# EAGLE design aruduino-shield (EAGLE 9.6.2)
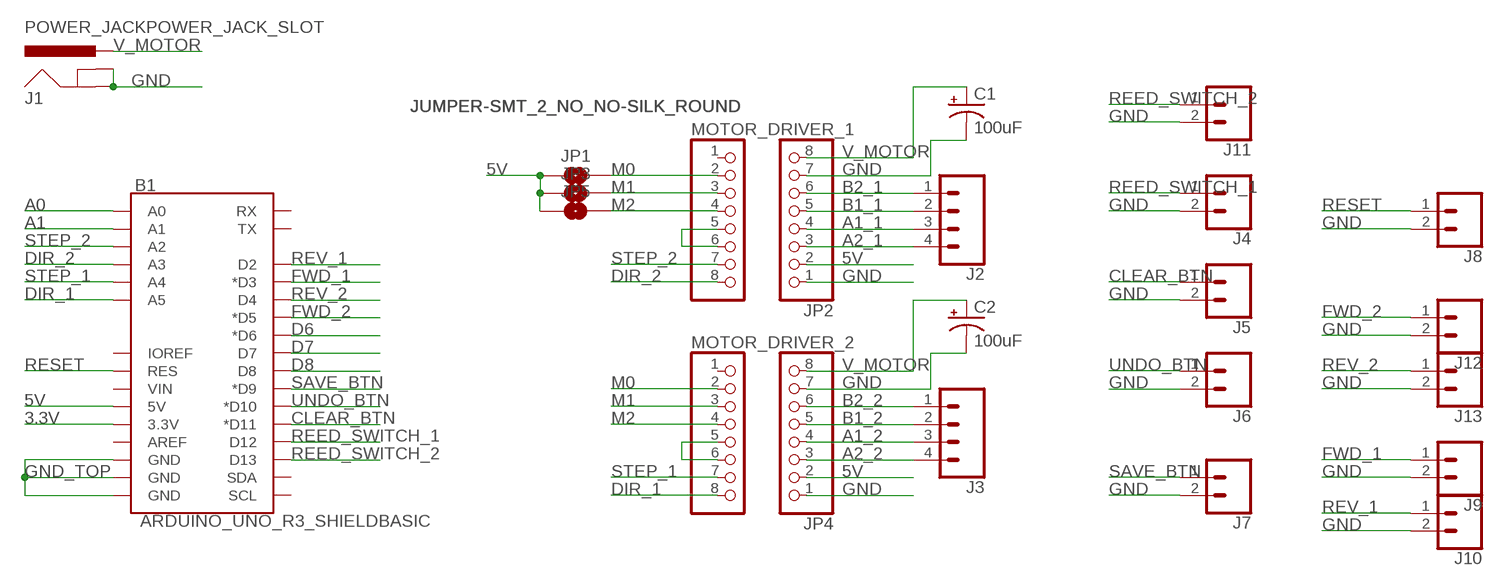
[diagram p0: schematic, sheet 1]

## Parts
B1  ARDUINO_UNO_R3_SHIELDBASIC  [UNO_R3_SHIELD]
C1  100uF  100UF-POLAR-RADIAL-2.5MM-25V-20%  [CPOL-RADIAL-2.5MM-6.5MM]
C2  100uF  100UF-POLAR-RADIAL-2.5MM-25V-20%  [CPOL-RADIAL-2.5MM-6.5MM]
J1  POWER_JACKPOWER_JACK_SLOT  [POWER_JACK_PTH_SLOT]
J2  CONN_04SCREW  [SCREWTERMINAL-3.5MM-4]
J3  CONN_04SCREW  [SCREWTERMINAL-3.5MM-4]
J4  CONN_02  [1X02]
J5  CONN_02  [1X02]
J6  CONN_02  [1X02]
J7  CONN_02  [1X02]
J8  CONN_02  [1X02]
J9  CONN_02  [1X02]
J10  CONN_02  [1X02]
J11  CONN_02  [1X02]
J12  CONN_02  [1X02]
J13  CONN_02  [1X02]
JP1  JUMPER-SMT_2_NO_NO-SILK_ROUND  [SMT-JUMPER_2_NO_NO-SILK_ROUND]
JP2  PINHD-1X8CLEANBIG  [1X08-CLEANBIG]
JP3  JUMPER-SMT_2_NO_NO-SILK_ROUND  [SMT-JUMPER_2_NO_NO-SILK_ROUND]
JP4  PINHD-1X8CLEANBIG  [1X08-CLEANBIG]
JP5  JUMPER-SMT_2_NO_NO-SILK_ROUND  [SMT-JUMPER_2_NO_NO-SILK_ROUND]
MOTOR_DRIVER_1  PINHD-1X8CLEANBIG  [1X08-CLEANBIG]
MOTOR_DRIVER_2  PINHD-1X8CLEANBIG  [1X08-CLEANBIG]

## Nets
3.3V: B1.3.3V
5V: B1.5V JP1.1 JP2.2 JP3.1 JP4.2 JP5.1
A0: B1.A0
A1: B1.A1
A1_1: J2.3 JP2.4
A1_2: J3.3 JP4.4
A2_1: J2.4 JP2.3
A2_2: J3.4 JP4.3
B1_1: J2.2 JP2.5
B1_2: J3.2 JP4.5
B2_1: J2.1 JP2.6
B2_2: J3.1 JP4.6
CLEAR_BTN: B1.D11(*D11) J5.1
D6: B1.D6(*D6)
D7: B1.D7
D8: B1.D8
DIR_1: B1.A5 MOTOR_DRIVER_2.8
DIR_2: B1.A3 MOTOR_DRIVER_1.8
FWD_1: B1.D3(*D3) J9.1
FWD_2: B1.D5(*D5) J12.1
GND: C1.2(-) C2.2(-) J1.GND J1.GNDBREAK J4.2 J5.2 J6.2 J7.2 J8.2 J9.2 J10.2 J11.2 J12.2 J13.2 JP2.1 JP2.7 JP4.1 JP4.7
GND_TOP: B1.GND@0(GND) B1.GND@1(GND) B1.GND@2(GND)
M0: JP1.2 MOTOR_DRIVER_1.2 MOTOR_DRIVER_2.2
M1: JP3.2 MOTOR_DRIVER_1.3 MOTOR_DRIVER_2.3
M2: JP5.2 MOTOR_DRIVER_1.4 MOTOR_DRIVER_2.4
N$1: MOTOR_DRIVER_2.5 MOTOR_DRIVER_2.6
N$2: MOTOR_DRIVER_1.5 MOTOR_DRIVER_1.6
REED_SWITCH_1: B1.D12 J4.1
REED_SWITCH_2: B1.D13 J11.1
RESET: B1.RES J8.1
REV_1: B1.D2 J10.1
REV_2: B1.D4 J13.1
SAVE_BTN: B1.D9(*D9) J7.1
STEP_1: B1.A4 MOTOR_DRIVER_2.7
STEP_2: B1.A2 MOTOR_DRIVER_1.7
UNDO_BTN: B1.D10(*D10) J6.1
V_MOTOR: C1.1(+) C2.1(+) J1.PWR JP2.8 JP4.8
Unconnected: B1.AREF B1.IOREF B1.RX B1.SCL B1.SDA B1.TX B1.VIN MOTOR_DRIVER_1.1 MOTOR_DRIVER_2.1

## Library data of the parts
B1 = SparkFun-Boards:ARDUINO_UNO_R3_SHIELD: Arduino R3 Shield Footprint Shield form compatible with the Arduino Uno R3. SparkFun Products: MG2639 Cellular Shield <https://www.sparkfun.com/products/13120> MIDI Shield <https://www.sparkfun.com/products/12898> R3 Stackable Headers Kit <https://www.sparkfun.com/products/11417>
C1 C2 = SparkFun-Capacitors:100UF-POLAR: 100µF polarized capacitors A capacitor is a passive two-terminal electrical component used to store electrical energy temporarily in an electric field.; PROD_ID: CAP-08439
J1 = SparkFun-Connectors:POWER_JACK: Power Jack Connector This is the standard 5.5mm barrel jack for power. The PTH is the most common, proven, reliable, footprint. The Slot footprint only works if the mill layer is transmitted to the PCB fab house so be warned. Here are the connectors we sell at SparkFun: DC Barrel Power Jack/Connector <https://www.sparkfun.com/products/119> (PRT-00119) DC Barrel Power Jack/Connector (SMD) <https://www.sparkfun.com/products/12748> (PRT-12748) DC Barrel Jack Adapter - Breadboard Compatible <https://www.sparkfun.com/products/10811> (PRT-10811) It is used on this SparkFun product (and many, many others): SparkFun RedBoard - Programmed with Arduino <https://www.sparkfun.com/products/12757> (DEV-12757) Also, if you need a mating power supply or connector, please check these out: Wall Adapter Power Supply - 9VDC 650mA <https://www.sparkfun.com/products/298> (TOL-00298) DC Barrel Jack Adapter - Male <https://www.sparkfun.com/products/10287> (PRT-10287); PROD_ID: CONN-08197
J2 J3 = SparkFun-Connectors:CONN_04: Multi connection point. Often used as Generic Header-pin footprint for 0.1 inch spaced/style header connections On any of the 0.1 inch spaced packages, you can populate with these: Break Away Headers - Straight <https://www.sparkfun.com/products/116> (PRT-00116) Break Away Male Headers - Right Angle <https://www.sparkfun.com/products/553> (PRT-00553) Female Headers <https://www.sparkfun.com/products/115> (PRT-00115) Break Away Headers - Machine Pin <https://www.sparkfun.com/products/117> (PRT-00117) Break Away Female Headers - Swiss Machine Pin <https://www.sparkfun.com/products/743> (PRT-00743) For SCREWTERMINALS and SPRING TERMINALS visit here: Screw Terimnals on SparkFun.com <https://www.sparkfun.com/search/results?term=Screw+Terminals> (5mm/3.5mm/2.54mm spacing) This device is also useful as a general connection point to wire up your design to another part of your project. Our various solder wires solder well into these plated through hole pads. Hook-Up Wire - Assortment (Stranded, 22 AWG) <https://www.sparkfun.com/products/11375> (PRT-11375) Hook-Up Wire - Assortment (Solid Core, 22 AWG) <https://www.sparkfun.com/products/11367> (PRT-11367) View the entire wire category on our website here <https://www.sparkfun.com/categories/141> Special notes: Molex polarized connector foot print use with SKU : PRT-08231 with associated crimp pins and housings. 1MM SMD Version SKU: PRT-10208; PROD_ID: CONN-14485
J4-J13 = SparkFun-Connectors:CONN_02: Multi connection point. Often used as Generic Header-pin footprint for 0.1 inch spaced/style header connections On any of the 0.1 inch spaced packages, you can populate with these: Break Away Headers - Straight <https://www.sparkfun.com/products/116> (PRT-00116) Break Away Male Headers - Right Angle <https://www.sparkfun.com/products/553> (PRT-00553) Female Headers <https://www.sparkfun.com/products/115> (PRT-00115) Break Away Headers - Machine Pin <https://www.sparkfun.com/products/117> (PRT-00117) Break Away Female Headers - Swiss Machine Pin <https://www.sparkfun.com/products/743> (PRT-00743) For SCREWTERMINALS and SPRING TERMINALS visit here: Screw Terimnals on SparkFun.com <https://www.sparkfun.com/search/results?term=Screw+Terminals> (5mm/3.5mm/2.54mm spacing) This device is also useful as a general connection point to wire up your design to another part of your project. Our various solder wires solder well into these plated through hole pads. Hook-Up Wire - Assortment (Stranded, 22 AWG) <https://www.sparkfun.com/products/11375> (PRT-11375) Hook-Up Wire - Assortment (Solid Core, 22 AWG) <https://www.sparkfun.com/products/11367> (PRT-11367) View the entire wire category on our website here <https://www.sparkfun.com/categories/141> Special notes: Molex polarized connector foot print use with: PRT-08233 with associated crimp pins and housings. 2.54_SCREWTERM for use with PRT-10571. 3.5mm Screw Terminal footprints for PRT-08084 5mm Screw Terminal footprints for use with PRT-08432
JP1 JP3 JP5 = SparkFun-Jumpers:JUMPER-SMT_2_NO: Normally open jumper This jumper has two pads in close proximity to each other. Apply solder to close the connection. Round pads are easier to solder for beginners, but are a lot larger. SparkFun Product that uses the round pads: SparkFun EL Sequencer <https://www.sparkfun.com/products/12781>
JP2 JP4 MOTOR_DRIVER_1 MOTOR_DRIVER_2 = adafruit:PINHD-1X8: PIN HEADER

## Board
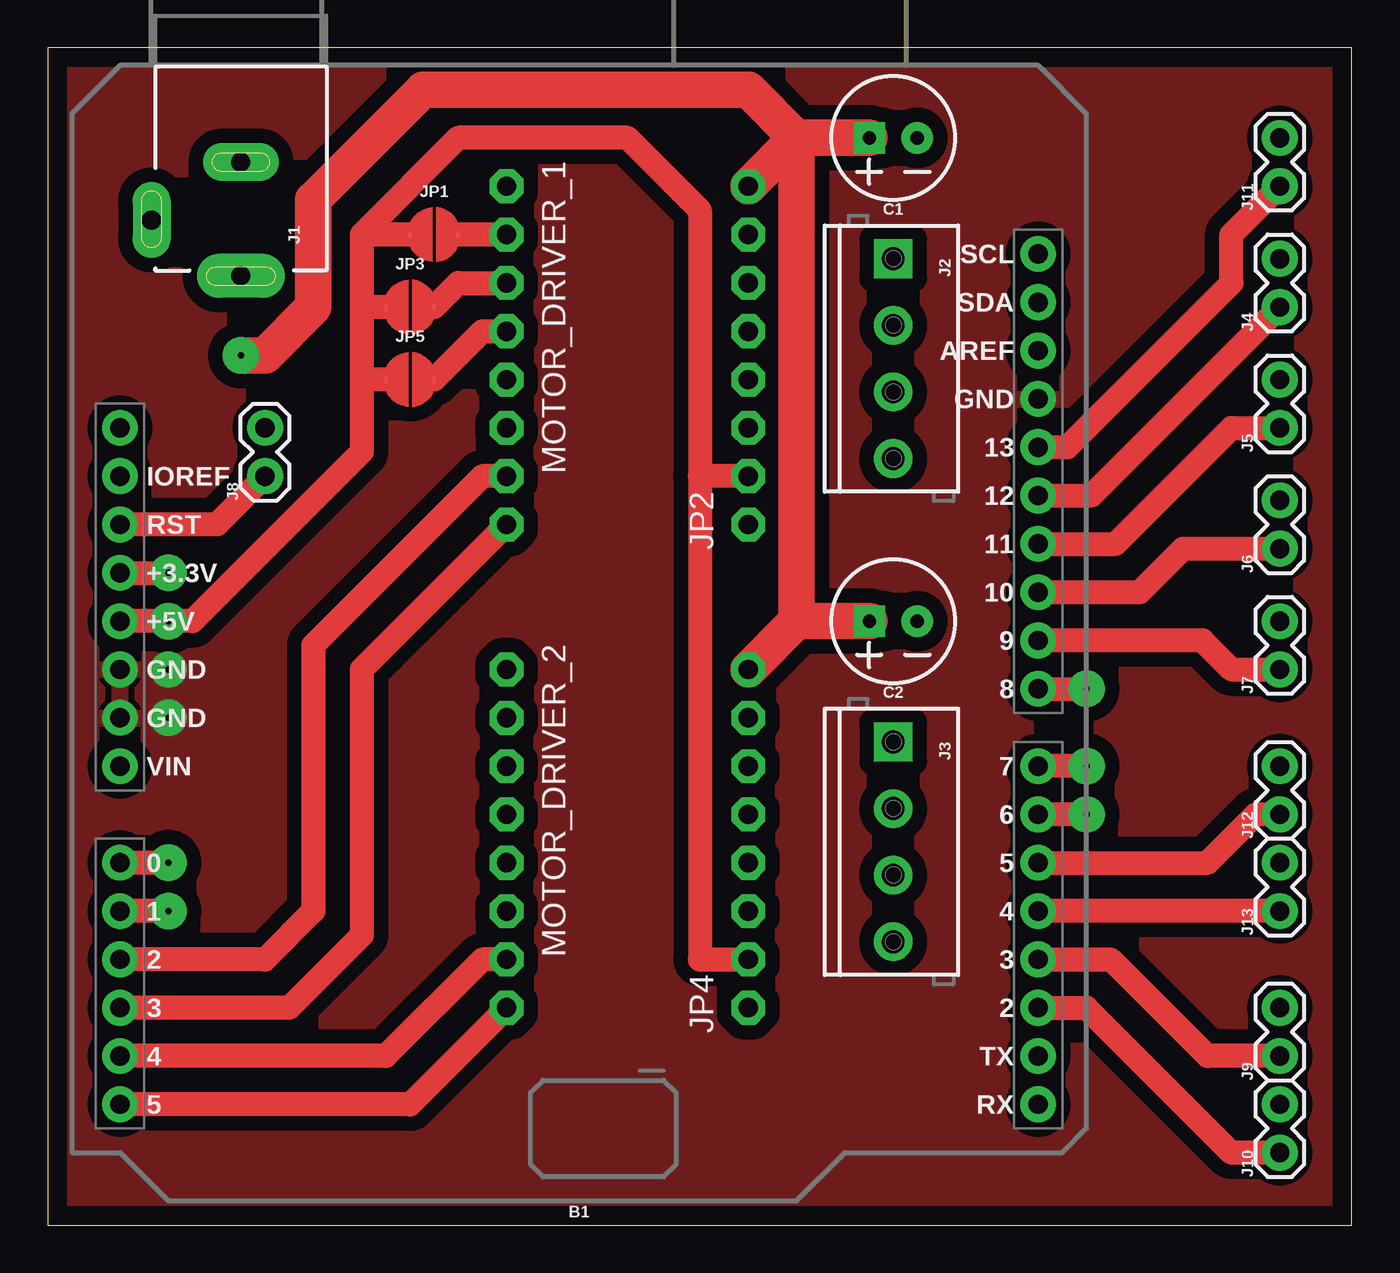
[diagram p1: board, top side]
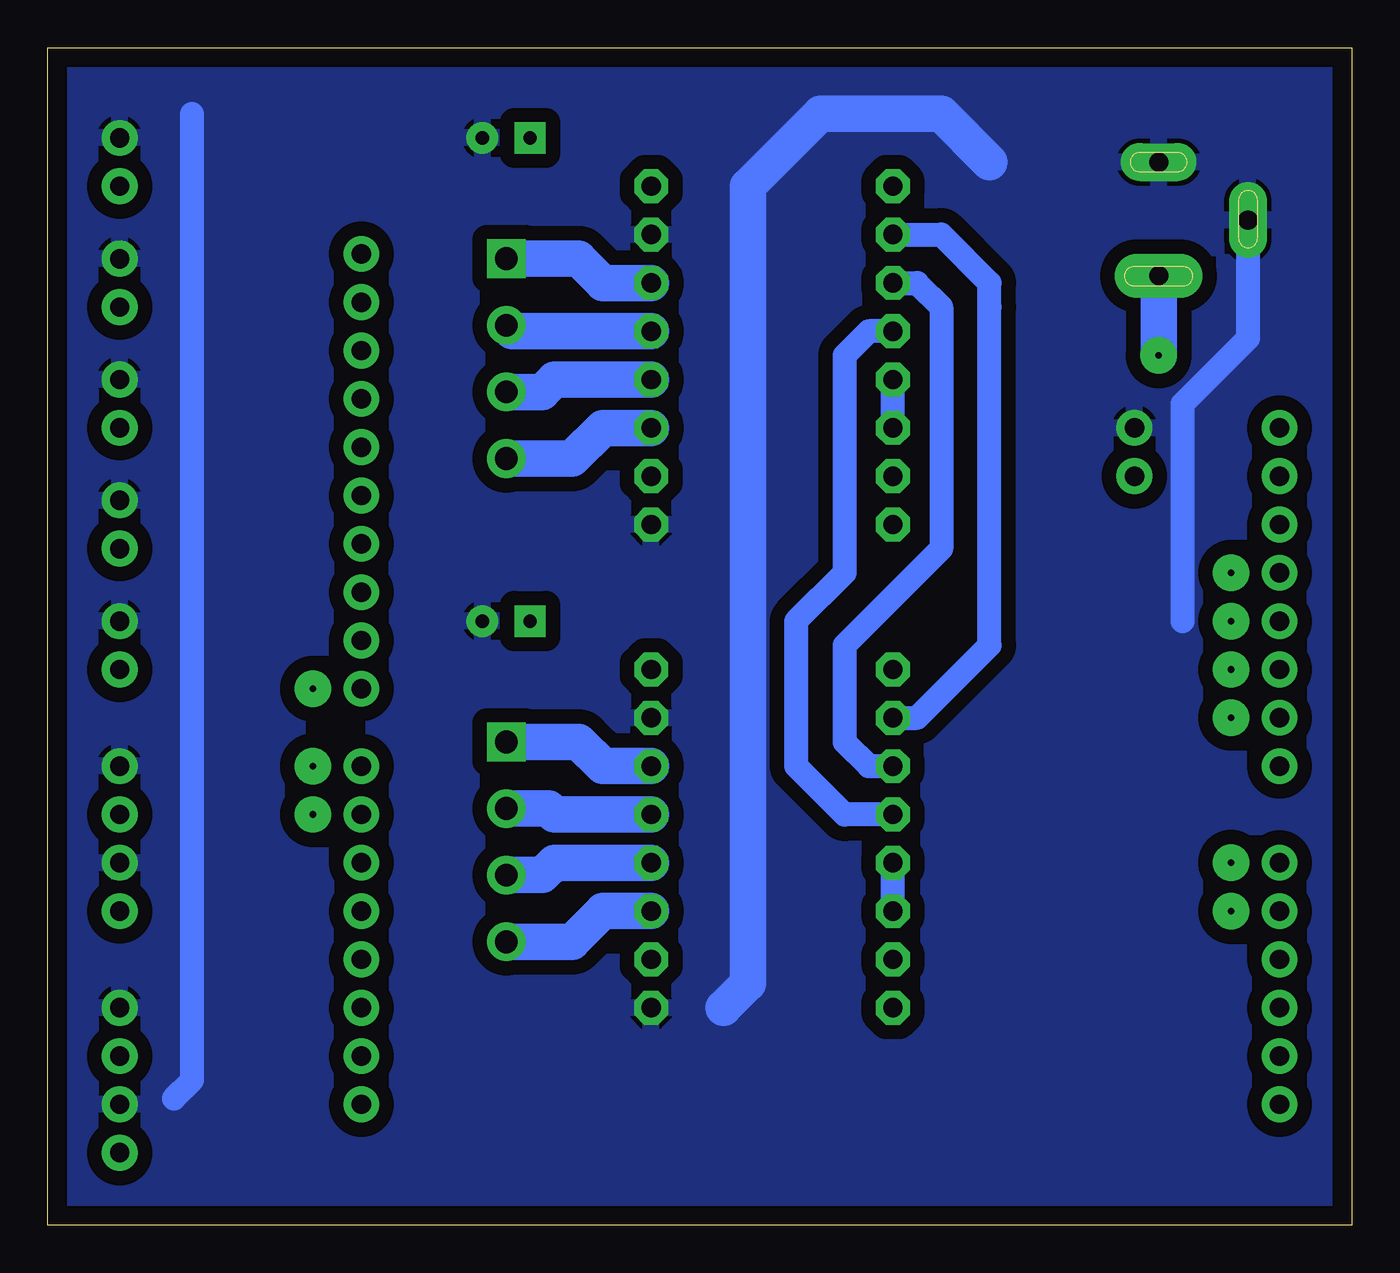
[diagram p2: board, bottom side, seen from below]

Size 68.56 x 61.9 mm. Coordinates in mm from the lower left corner, seen from the top.
Outline: 0,0 68.56,0 68.56,61.9 0,61.9 0,0
Copper layers (1*16): Top 0.035mm / dielectric 1.5mm / Bottom 0.035mm
Design rules "default": minimum track width 6mil, minimum drill 0.35mm, track to track 6mil, track to pad 6mil, pad to pad 6mil, via to via 6mil, smd to smd 6mil, copper to edge 40mil, drill to drill 6mil, minimum pad ring 10mil, minimum via ring 8mil, stop-mask expansion 4mil, vias tented up to drill 0mil, thermal gap 10mil

### Footprints (pad centres in the part's own frame; a part is rotated, then mirrored left to right if it is on the bottom)
UNO_R3_SHIELD = drill 1.016 pad 1.88: 3.3V 24.13,-2.54; 5V 24.13,0; A0 24.13,12.7; A1 24.13,15.24; A2 24.13,17.78; A3 24.13,20.32; A4 24.13,22.86; A5 24.13,25.4; AREF -24.13,-14.224; D2 -24.13,20.32; D3 -24.13,17.78; D4 -24.13,15.24; D5 -24.13,12.7; D6 -24.13,10.16; D7 -24.13,7.62; D8 -24.13,3.556; D9 -24.13,1.016; D10 -24.13,-1.524; D11 -24.13,-4.064; D12 -24.13,-6.604; D13 -24.13,-9.144; GND@0 24.13,2.54; GND@1 24.13,5.08; GND@2 -24.13,-11.684; IOREF 24.13,-7.62; NC 24.13,-10.16; RES 24.13,-5.08; RX -24.13,25.4; SCL -24.13,-19.304; SDA -24.13,-16.764; TX -24.13,22.86; VIN 24.13,7.62
CPOL-RADIAL-2.5MM-6.5MM = drill 0.7 pad 1.651 square: 1 1.25,0 | drill 0.7 pad 1.651: 2 -1.25,0
POWER_JACK_PTH_SLOT = drill 1 pad 2 long: GND 0,0; GNDBREAK -3.048,4.699 | drill 1 pad 2.3 long: PWR -5.969,0
SCREWTERMINAL-3.5MM-4 = drill 1.2 pad 2.032 square: 1 0,0 | drill 1.2 pad 2.032: 2 3.5,0; 3 7,0; 4 10.5,0
1X02 = drill 1.016 pad 1.88: 1 0,0; 2 2.54,0
SMT-JUMPER_2_NO_NO-SILK_ROUND = smd 0.152 x 0.305: 1 -1.27,0; 2 1.27,0
1X08-CLEANBIG = drill 1.016 pad 1.778 octagon: 1 -8.89,0; 2 -6.35,0; 3 -3.81,0; 4 -1.27,0; 5 1.27,0; 6 3.81,0; 7 6.35,0; 8 8.89,0

### Placement (x,y rotation side)
B1  27.94,31.75 180 top
C1  44.45,57.15 180 top
C2  44.45,31.75 180 top
J1  10.16,55.88 90 top
J2  44.45,50.8 270 top
J3  44.45,25.4 270 top
J4  64.77,48.26 90 top
J5  64.77,41.91 90 top
J6  64.77,35.56 90 top
J7  64.77,29.21 90 top
J8  11.43,39.37 90 top
J9  64.77,8.89 90 top
J10  64.77,3.81 90 top
J11  64.77,54.61 90 top
J12  64.77,21.59 90 top
J13  64.77,16.51 90 top
JP1  20.32,52.07 0 top
JP2  36.83,45.72 90 top
JP3  19.05,48.26 0 top
JP4  36.83,20.32 90 top
JP5  19.05,44.45 0 top
MOTOR_DRIVER_1  24.13,45.72 270 top
MOTOR_DRIVER_2  24.13,20.32 270 top

### Tracks (layer width: path | path; a pad name or v marks a point on that pad's centre or on a via)
3.3V  (via drill 0.35 pad 1.91)
  Top 1.27: B1.3.3V v6.35,34.29
5V  (via drill 0.35 pad 1.91)
  Top 1.27: JP4.2 34.29,13.97 34.29,39.37 | JP2.2 34.29,39.37 | 34.29,39.37 34.29,53.34 30.48,57.15 21.59,57.15 16.51,52.07 | 16.51,52.07 16.51,48.26 | 16.51,48.26 16.51,44.45 | 16.51,44.45 16.51,40.64 7.62,31.75 v6.35,31.75 B1.5V | JP1.1 16.51,52.07 | JP5.1 16.51,44.45 | JP3.1 16.51,48.26
A0  (via drill 0.35 pad 1.91)
  Top 1.27: v6.35,19.05 B1.A0
A1  (via drill 0.35 pad 1.91)
  Top 1.27: v6.35,16.51 B1.A1
A1_1
  Bottom 1.905: J2.3 42.56,43.8 41.91,44.45 JP2.4
A1_2
  Bottom 1.905: J3.3 42.56,18.4 41.91,19.05 JP4.4
A2_1
  Bottom 1.905: JP2.3 39.37,41.91 40.98,40.3 J2.4
A2_2
  Bottom 1.905: JP4.3 39.37,16.51 40.98,14.9 J3.4
B1_1
  Bottom 1.905: J2.2 44.14,46.99 JP2.5
B1_2
  Bottom 1.905: J3.2 42.22,21.9 41.91,21.59 JP4.5
B2_1
  Bottom 1.905: JP2.6 39.37,49.53 40.64,50.8 J2.1
B2_2
  Bottom 1.905: J3.1 40.64,25.4 39.37,24.13 JP4.6
CLEAR_BTN
  Top 1.27: B1.D11 56.13,35.81 62.23,41.91 J5.1
D6  (via drill 0.35 pad 1.91)
  Top 1.27: v54.61,21.59 B1.D6
D7  (via drill 0.35 pad 1.91)
  Top 1.27: v54.61,24.13 B1.D7
D8  (via drill 0.35 pad 1.91)
  Top 1.27: B1.D8 v54.61,28.19
DIR_1
  Top 1.27: MOTOR_DRIVER_2.8 19.05,6.35 B1.A5
DIR_2
  Top 1.27: MOTOR_DRIVER_1.8 16.51,29.21 16.51,15.24 12.7,11.43 B1.A3
FWD_1
  Top 1.27: B1.D3 55.88,13.97 60.96,8.89 J9.1
FWD_2
  Top 1.27: B1.D5 60.96,19.05 63.5,21.59 J12.1
GND
  Bottom 1.27: 60.96,58.42 60.96,7.62 61.92,6.66 | J1.GNDBREAK 5.46,46.61 8.89,43.18 8.89,31.75
  Bottom 1.905: 33.02,11.43 31.75,12.7 31.75,54.61 27.94,58.42 21.59,58.42 19.05,55.88
  pour Bottom (isolate 0.762): -1.27,63.5 69.85,63.5 69.85,-1.27 -1.27,-1.27
GND_TOP  (via drill 0.35 pad 1.91)
  other vias: 6.35,29.21 6.35,26.67
  pour Top (isolate 0.762): 0,62.23 68.58,62.23 68.58,0 0,0
M0
  Top 1.27: MOTOR_DRIVER_1.2 JP1.2
  Bottom 1.27: MOTOR_DRIVER_1.2 JP1.2 19.05,49.53 19.05,48.26 19.05,30.48 22.86,26.67 MOTOR_DRIVER_2.2
M1
  Top 1.27: MOTOR_DRIVER_1.3 21.59,49.53 JP3.2
  Bottom 1.27: MOTOR_DRIVER_1.3 22.86,49.53 21.59,48.26 21.59,35.56 26.67,30.48 26.67,25.4 25.4,24.13 MOTOR_DRIVER_2.3
M2
  Top 1.27: MOTOR_DRIVER_1.4 22.86,46.99 JP5.2
  Bottom 1.27: MOTOR_DRIVER_1.4 25.4,46.99 26.67,45.72 26.67,34.29 29.21,31.75 29.21,24.13 26.67,21.59 MOTOR_DRIVER_2.4
N$1
  Bottom 1.27: MOTOR_DRIVER_2.6 MOTOR_DRIVER_2.5
N$2
  Bottom 1.27: MOTOR_DRIVER_1.6 MOTOR_DRIVER_1.5
REED_SWITCH_1
  Top 1.27: B1.D12 54.86,38.35 J4.1
REED_SWITCH_2
  Top 1.27: B1.D13 53.59,40.89 62.23,49.53 62.23,52.07 J11.1
RESET
  Top 1.27: J8.1 8.89,36.83 B1.RES
REV_1
  Top 1.27: B1.D2 54.61,11.43 62.23,3.81 J10.1
REV_2
  Top 1.27: J13.1 B1.D4
SAVE_BTN
  Top 1.27: B1.D9 60.71,30.73 62.23,29.21 J7.1
STEP_1
  Top 1.27: MOTOR_DRIVER_2.7 22.86,13.97 17.78,8.89 B1.A4
STEP_2
  Top 1.27: MOTOR_DRIVER_1.7 22.86,39.37 13.97,30.48 13.97,16.51 11.43,13.97 B1.A2
UNDO_BTN
  Top 1.27: B1.D10 57.4,33.27 59.69,35.56 J6.1
V_MOTOR  (via drill 0.35, 0.35 pad 1.91)
  Top 1.905: JP4.8 39.37,31.75 | 39.37,31.75 39.37,57.15 | 39.37,57.15 39.37,57.17 | 39.37,57.17 39.35,57.17 36.83,59.69 19.75,59.69 13.97,53.91 13.97,48.26 11.43,45.72 v10.16,45.72 | JP2.8 39.37,57.15 | C1.1 39.39,57.15 39.37,57.17 | 39.39,57.17 39.37,57.15 | C2.1 39.37,31.75
  Bottom 1.905: J1.PWR v10.16,45.72
  other vias: 10.16,49.91